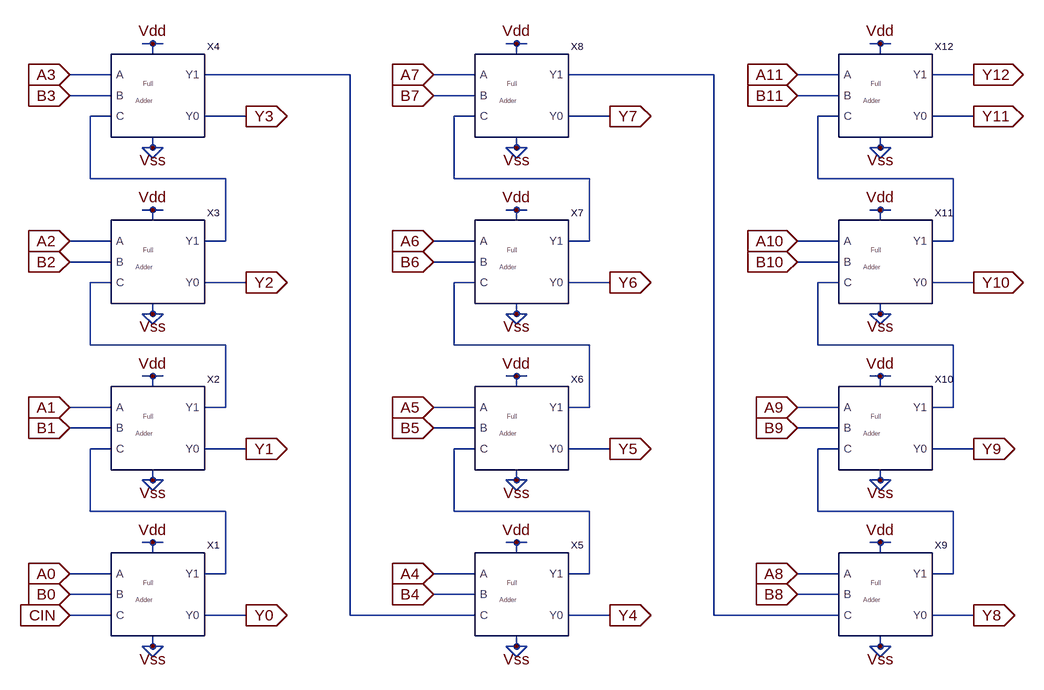
[diagram p0: schematic 12bitadder.asc]
12bitadder.asc, the LTspice schematic file:
Version 4
SHEET 1 3036 1012
WIRE 1104 32 1088 32
WIRE 1120 32 1104 32
WIRE 1664 32 1648 32
WIRE 1680 32 1664 32
WIRE 2224 32 2208 32
WIRE 2240 32 2224 32
WIRE 1104 48 1104 32
WIRE 1664 48 1664 32
WIRE 2224 48 2224 32
WIRE 1040 80 976 80
WIRE 1408 80 1184 80
WIRE 1600 80 1536 80
WIRE 1968 80 1744 80
WIRE 2160 80 2096 80
WIRE 2368 80 2304 80
WIRE 1040 112 976 112
WIRE 1600 112 1536 112
WIRE 2160 112 2096 112
WIRE 1040 144 1008 144
WIRE 1248 144 1184 144
WIRE 1600 144 1568 144
WIRE 1808 144 1744 144
WIRE 2160 144 2128 144
WIRE 2368 144 2304 144
WIRE 1104 192 1104 176
WIRE 1104 192 1088 192
WIRE 1120 192 1104 192
WIRE 1664 192 1664 176
WIRE 1664 192 1648 192
WIRE 1680 192 1664 192
WIRE 2224 192 2224 176
WIRE 2224 192 2208 192
WIRE 2240 192 2224 192
WIRE 1104 208 1088 192
WIRE 1104 208 1120 192
WIRE 1664 208 1648 192
WIRE 1664 208 1680 192
WIRE 2224 208 2208 192
WIRE 2224 208 2240 192
WIRE 1008 240 1008 144
WIRE 1216 240 1008 240
WIRE 1568 240 1568 144
WIRE 1776 240 1568 240
WIRE 2128 240 2128 144
WIRE 2336 240 2128 240
WIRE 1104 288 1088 288
WIRE 1120 288 1104 288
WIRE 1664 288 1648 288
WIRE 1680 288 1664 288
WIRE 2224 288 2208 288
WIRE 2240 288 2224 288
WIRE 1104 304 1104 288
WIRE 1664 304 1664 288
WIRE 2224 304 2224 288
WIRE 1040 336 976 336
WIRE 1216 336 1216 240
WIRE 1216 336 1184 336
WIRE 1600 336 1536 336
WIRE 1776 336 1776 240
WIRE 1776 336 1744 336
WIRE 2160 336 2096 336
WIRE 2336 336 2336 240
WIRE 2336 336 2304 336
WIRE 1040 368 976 368
WIRE 1600 368 1536 368
WIRE 2160 368 2096 368
WIRE 1040 400 1008 400
WIRE 1248 400 1184 400
WIRE 1600 400 1568 400
WIRE 1808 400 1744 400
WIRE 2160 400 2128 400
WIRE 2368 400 2304 400
WIRE 1104 448 1104 432
WIRE 1104 448 1088 448
WIRE 1120 448 1104 448
WIRE 1664 448 1664 432
WIRE 1664 448 1648 448
WIRE 1680 448 1664 448
WIRE 2224 448 2224 432
WIRE 2224 448 2208 448
WIRE 2240 448 2224 448
WIRE 1104 464 1088 448
WIRE 1104 464 1120 448
WIRE 1664 464 1648 448
WIRE 1664 464 1680 448
WIRE 2224 464 2208 448
WIRE 2224 464 2240 448
WIRE 1008 496 1008 400
WIRE 1216 496 1008 496
WIRE 1568 496 1568 400
WIRE 1776 496 1568 496
WIRE 2128 496 2128 400
WIRE 2336 496 2128 496
WIRE 1104 544 1088 544
WIRE 1120 544 1104 544
WIRE 1664 544 1648 544
WIRE 1680 544 1664 544
WIRE 2224 544 2208 544
WIRE 2240 544 2224 544
WIRE 1104 560 1104 544
WIRE 1664 560 1664 544
WIRE 2224 560 2224 544
WIRE 1040 592 976 592
WIRE 1216 592 1216 496
WIRE 1216 592 1184 592
WIRE 1600 592 1536 592
WIRE 1776 592 1776 496
WIRE 1776 592 1744 592
WIRE 2160 592 2096 592
WIRE 2336 592 2336 496
WIRE 2336 592 2304 592
WIRE 1040 624 976 624
WIRE 1600 624 1536 624
WIRE 2160 624 2096 624
WIRE 1040 656 1008 656
WIRE 1248 656 1184 656
WIRE 1600 656 1568 656
WIRE 1808 656 1744 656
WIRE 2160 656 2128 656
WIRE 2368 656 2304 656
WIRE 1104 704 1104 688
WIRE 1104 704 1088 704
WIRE 1120 704 1104 704
WIRE 1664 704 1664 688
WIRE 1664 704 1648 704
WIRE 1680 704 1664 704
WIRE 2224 704 2224 688
WIRE 2224 704 2208 704
WIRE 2240 704 2224 704
WIRE 1104 720 1088 704
WIRE 1104 720 1120 704
WIRE 1664 720 1648 704
WIRE 1664 720 1680 704
WIRE 2224 720 2208 704
WIRE 2224 720 2240 704
WIRE 1008 752 1008 656
WIRE 1216 752 1008 752
WIRE 1568 752 1568 656
WIRE 1776 752 1568 752
WIRE 2128 752 2128 656
WIRE 2336 752 2128 752
WIRE 1104 800 1088 800
WIRE 1120 800 1104 800
WIRE 1664 800 1648 800
WIRE 1680 800 1664 800
WIRE 2224 800 2208 800
WIRE 2240 800 2224 800
WIRE 1104 816 1104 800
WIRE 1664 816 1664 800
WIRE 2224 816 2224 800
WIRE 1040 848 976 848
WIRE 1216 848 1216 752
WIRE 1216 848 1184 848
WIRE 1600 848 1536 848
WIRE 1776 848 1776 752
WIRE 1776 848 1744 848
WIRE 2160 848 2096 848
WIRE 2336 848 2336 752
WIRE 2336 848 2304 848
WIRE 1040 880 976 880
WIRE 1600 880 1536 880
WIRE 2160 880 2096 880
WIRE 1040 912 976 912
WIRE 1248 912 1184 912
WIRE 1408 912 1408 80
WIRE 1600 912 1408 912
WIRE 1808 912 1744 912
WIRE 1968 912 1968 80
WIRE 2160 912 1968 912
WIRE 2368 912 2304 912
WIRE 1104 960 1104 944
WIRE 1104 960 1088 960
WIRE 1120 960 1104 960
WIRE 1664 960 1664 944
WIRE 1664 960 1648 960
WIRE 1680 960 1664 960
WIRE 2224 960 2224 944
WIRE 2224 960 2208 960
WIRE 2240 960 2224 960
WIRE 1104 976 1088 960
WIRE 1104 976 1120 960
WIRE 1664 976 1648 960
WIRE 1664 976 1680 960
WIRE 2224 976 2208 960
WIRE 2224 976 2240 960
FLAG 976 848 A0
IOPIN 976 848 In
FLAG 976 880 B0
IOPIN 976 880 In
FLAG 1104 800 Vdd
FLAG 1104 960 Vss
FLAG 976 592 A1
IOPIN 976 592 In
FLAG 976 624 B1
IOPIN 976 624 In
FLAG 1104 544 Vdd
FLAG 1104 704 Vss
FLAG 976 336 A2
IOPIN 976 336 In
FLAG 976 368 B2
IOPIN 976 368 In
FLAG 1104 288 Vdd
FLAG 1104 448 Vss
FLAG 976 80 A3
IOPIN 976 80 In
FLAG 976 112 B3
IOPIN 976 112 In
FLAG 1104 32 Vdd
FLAG 1104 192 Vss
FLAG 976 912 CIN
IOPIN 976 912 In
FLAG 1248 912 Y0
IOPIN 1248 912 Out
FLAG 1248 656 Y1
IOPIN 1248 656 Out
FLAG 1248 400 Y2
IOPIN 1248 400 Out
FLAG 1248 144 Y3
IOPIN 1248 144 Out
FLAG 1536 848 A4
IOPIN 1536 848 In
FLAG 1536 880 B4
IOPIN 1536 880 In
FLAG 1664 800 Vdd
FLAG 1664 960 Vss
FLAG 1536 592 A5
IOPIN 1536 592 In
FLAG 1536 624 B5
IOPIN 1536 624 In
FLAG 1664 544 Vdd
FLAG 1664 704 Vss
FLAG 1536 336 A6
IOPIN 1536 336 In
FLAG 1536 368 B6
IOPIN 1536 368 In
FLAG 1664 288 Vdd
FLAG 1664 448 Vss
FLAG 1536 80 A7
IOPIN 1536 80 In
FLAG 1536 112 B7
IOPIN 1536 112 In
FLAG 1664 32 Vdd
FLAG 1664 192 Vss
FLAG 1808 912 Y4
IOPIN 1808 912 Out
FLAG 1808 656 Y5
IOPIN 1808 656 Out
FLAG 1808 400 Y6
IOPIN 1808 400 Out
FLAG 1808 144 Y7
IOPIN 1808 144 Out
FLAG 2096 848 A8
IOPIN 2096 848 In
FLAG 2096 880 B8
IOPIN 2096 880 In
FLAG 2224 800 Vdd
FLAG 2224 960 Vss
FLAG 2096 592 A9
IOPIN 2096 592 In
FLAG 2096 624 B9
IOPIN 2096 624 In
FLAG 2224 544 Vdd
FLAG 2224 704 Vss
FLAG 2096 336 A10
IOPIN 2096 336 In
FLAG 2096 368 B10
IOPIN 2096 368 In
FLAG 2224 288 Vdd
FLAG 2224 448 Vss
FLAG 2096 80 A11
IOPIN 2096 80 In
FLAG 2096 112 B11
IOPIN 2096 112 In
FLAG 2224 32 Vdd
FLAG 2224 192 Vss
FLAG 2368 912 Y8
IOPIN 2368 912 Out
FLAG 2368 656 Y9
IOPIN 2368 656 Out
FLAG 2368 400 Y10
IOPIN 2368 400 Out
FLAG 2368 144 Y11
IOPIN 2368 144 Out
FLAG 2368 80 Y12
IOPIN 2368 80 Out
SYMBOL fulladder 1040 944 R0
SYMATTR InstName X1
SYMBOL fulladder 1040 688 R0
SYMATTR InstName X2
SYMBOL fulladder 1040 432 R0
SYMATTR InstName X3
SYMBOL fulladder 1040 176 R0
SYMATTR InstName X4
SYMBOL fulladder 1600 944 R0
SYMATTR InstName X5
SYMBOL fulladder 1600 688 R0
SYMATTR InstName X6
SYMBOL fulladder 1600 432 R0
SYMATTR InstName X7
SYMBOL fulladder 1600 176 R0
SYMATTR InstName X8
SYMBOL fulladder 2160 944 R0
SYMATTR InstName X9
SYMBOL fulladder 2160 688 R0
SYMATTR InstName X10
SYMBOL fulladder 2160 432 R0
SYMATTR InstName X11
SYMBOL fulladder 2160 176 R0
SYMATTR InstName X12

The netlist it stands for:
* 12bitadder.asc
XX1 A0 B0 Y0 N009 Vdd Vss CIN fulladder  ; pins A B Y0 Y1 Vdd Vss C
XX2 A1 B1 Y1 N006 Vdd Vss N009 fulladder  ; pins A B Y0 Y1 Vdd Vss C
XX3 A2 B2 Y2 N003 Vdd Vss N006 fulladder  ; pins A B Y0 Y1 Vdd Vss C
XX4 A3 B3 Y3 N001 Vdd Vss N003 fulladder  ; pins A B Y0 Y1 Vdd Vss C
XX5 A4 B4 Y4 N010 Vdd Vss N001 fulladder  ; pins A B Y0 Y1 Vdd Vss C
XX6 A5 B5 Y5 N007 Vdd Vss N010 fulladder  ; pins A B Y0 Y1 Vdd Vss C
XX7 A6 B6 Y6 N004 Vdd Vss N007 fulladder  ; pins A B Y0 Y1 Vdd Vss C
XX8 A7 B7 Y7 N002 Vdd Vss N004 fulladder  ; pins A B Y0 Y1 Vdd Vss C
XX9 A8 B8 Y8 N011 Vdd Vss N002 fulladder  ; pins A B Y0 Y1 Vdd Vss C
XX10 A9 B9 Y9 N008 Vdd Vss N011 fulladder  ; pins A B Y0 Y1 Vdd Vss C
XX11 A10 B10 Y10 N005 Vdd Vss N008 fulladder  ; pins A B Y0 Y1 Vdd Vss C
XX12 A11 B11 Y11 Y12 Vdd Vss N005 fulladder  ; pins A B Y0 Y1 Vdd Vss C
.backanno
.end